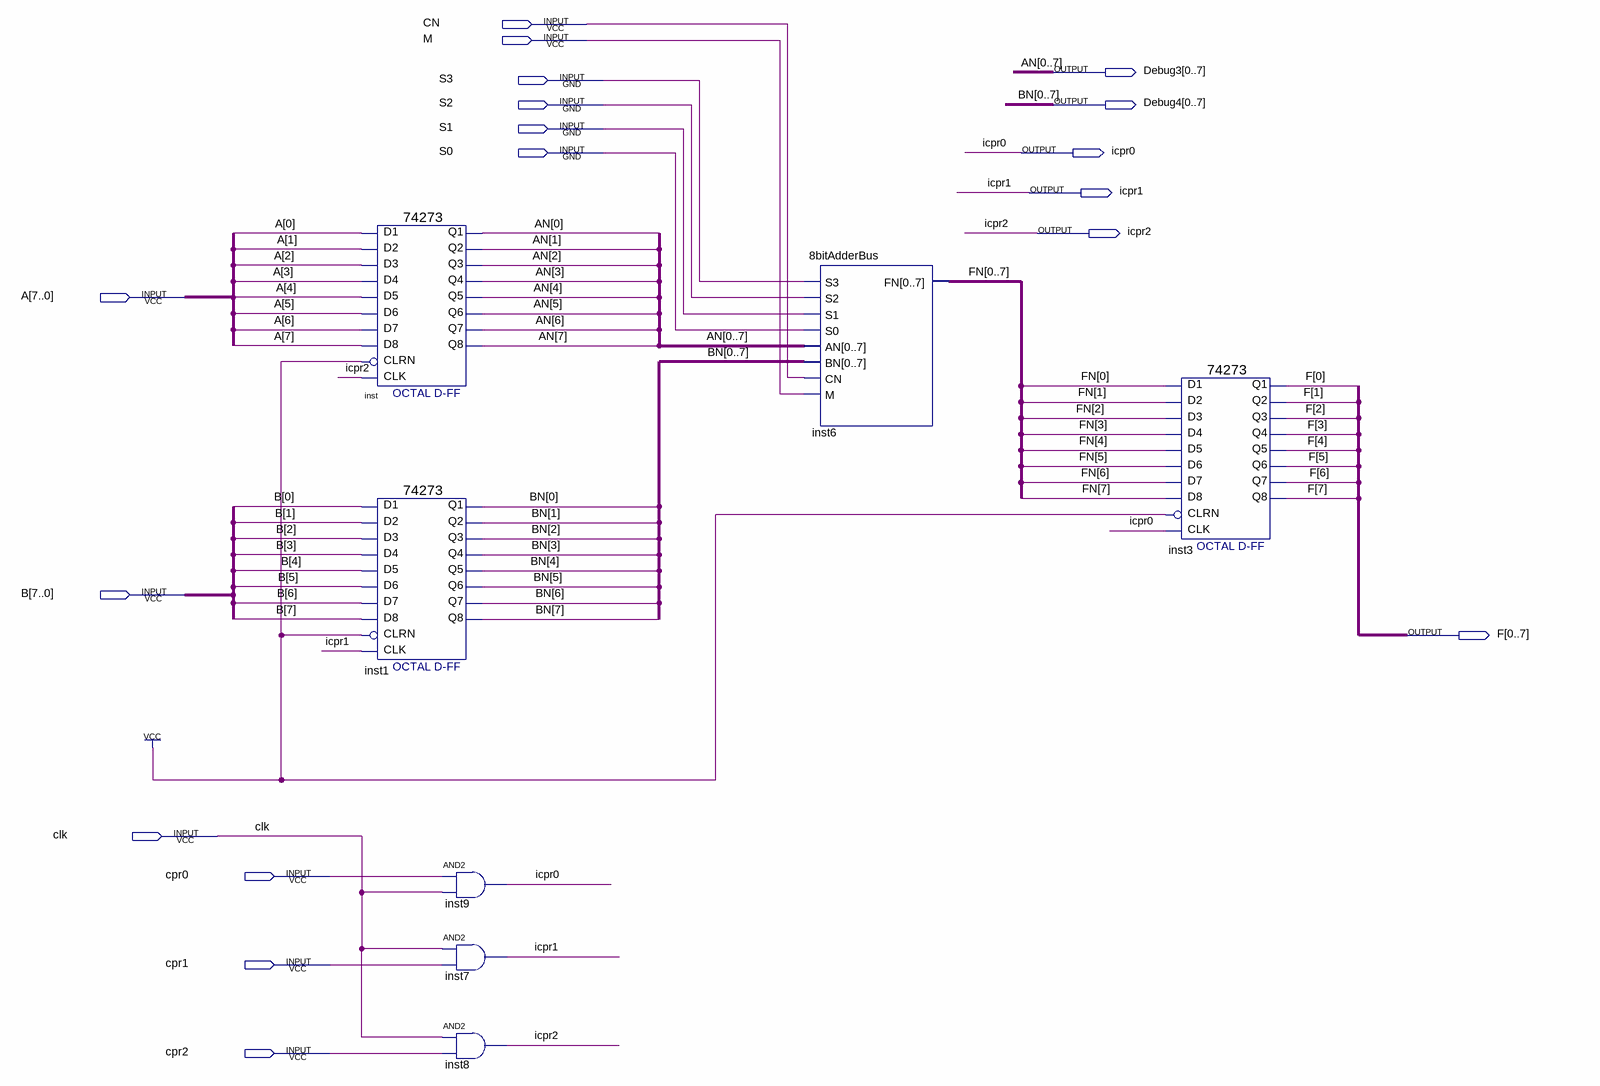
[diagram p0: schematic sheet]
// Quartus schematic alu.bdf as structural Verilog: 7 symbols, 18 pins
module alu (
  input  CN,
  input  M,
  input  S3,
  input  S2,
  input  S1,
  input  S0,
  input  [7:0] A,
  input  [7:0] B,
  input  clk,
  input  cpr0,
  input  cpr1,
  input  cpr2,
  output [0:7] Debug3,
  output [0:7] Debug4,
  output icpr0,
  output icpr1,
  output icpr2,
  output [0:7] F
);

  wire [7:0] FN;

  \74273  inst (
    .D2(A[1]), .D3(A[2]), .D1(A[0]), .D4(A[3]), .D7(A[6]), .D6(A[5]), .D5(A[4]), .D8(A[7]), .CLK(icpr2),
    .CLRN(1'b1), .Q4(Debug3[3]), .Q1(Debug3[0]), .Q2(Debug3[1]), .Q3(Debug3[2]), .Q6(Debug3[5]),
    .Q5(Debug3[4]), .Q7(Debug3[6]), .Q8(Debug3[7]));
  \74273  inst1 (
    .D2(B[1]), .D3(B[2]), .D1(B[0]), .D4(B[3]), .D7(B[6]), .D6(B[5]), .D5(B[4]), .D8(B[7]), .CLK(icpr1),
    .CLRN(1'b1), .Q4(Debug4[3]), .Q1(Debug4[0]), .Q2(Debug4[1]), .Q3(Debug4[2]), .Q6(Debug4[5]),
    .Q5(Debug4[4]), .Q7(Debug4[6]), .Q8(Debug4[7]));
  and inst9 (icpr0, cpr0, clk);
  and inst7 (icpr1, clk, cpr1);
  and inst8 (icpr2, clk, cpr2);
  \8bitAdderBus  inst6 (
    .S3(S3), .S2(S2), .S1(S1), .S0(S0), .AN(Debug3), .BN(Debug4), .CN(CN), .M(M),
    .FN({FN[0], FN[1], FN[2], FN[3], FN[4], FN[5], FN[6], FN[7]}));
  \74273  inst3 (
    .D2(FN[1]), .D3(FN[2]), .D1(FN[0]), .D4(FN[3]), .D7(FN[6]), .D6(FN[5]), .D5(FN[4]), .D8(FN[7]),
    .CLK(icpr0), .CLRN(1'b1), .Q4(F[3]), .Q1(F[0]), .Q2(F[1]), .Q3(F[2]), .Q6(F[5]), .Q5(F[4]), .Q7(F[6]),
    .Q8(F[7]));

  // Other names for the same wires on the sheet: AN[7:0] = {Debug3[7], Debug3[6], Debug3[5], Debug3[4], Debug3[3], Debug3[2], Debug3[1], Debug3[0]};
  //   BN[7:0] = {Debug4[7], Debug4[6], Debug4[5], Debug4[4], Debug4[3], Debug4[2], Debug4[1], Debug4[0]}
endmodule
